# EAGLE design usbpsu2 (EAGLE 7.7.0)
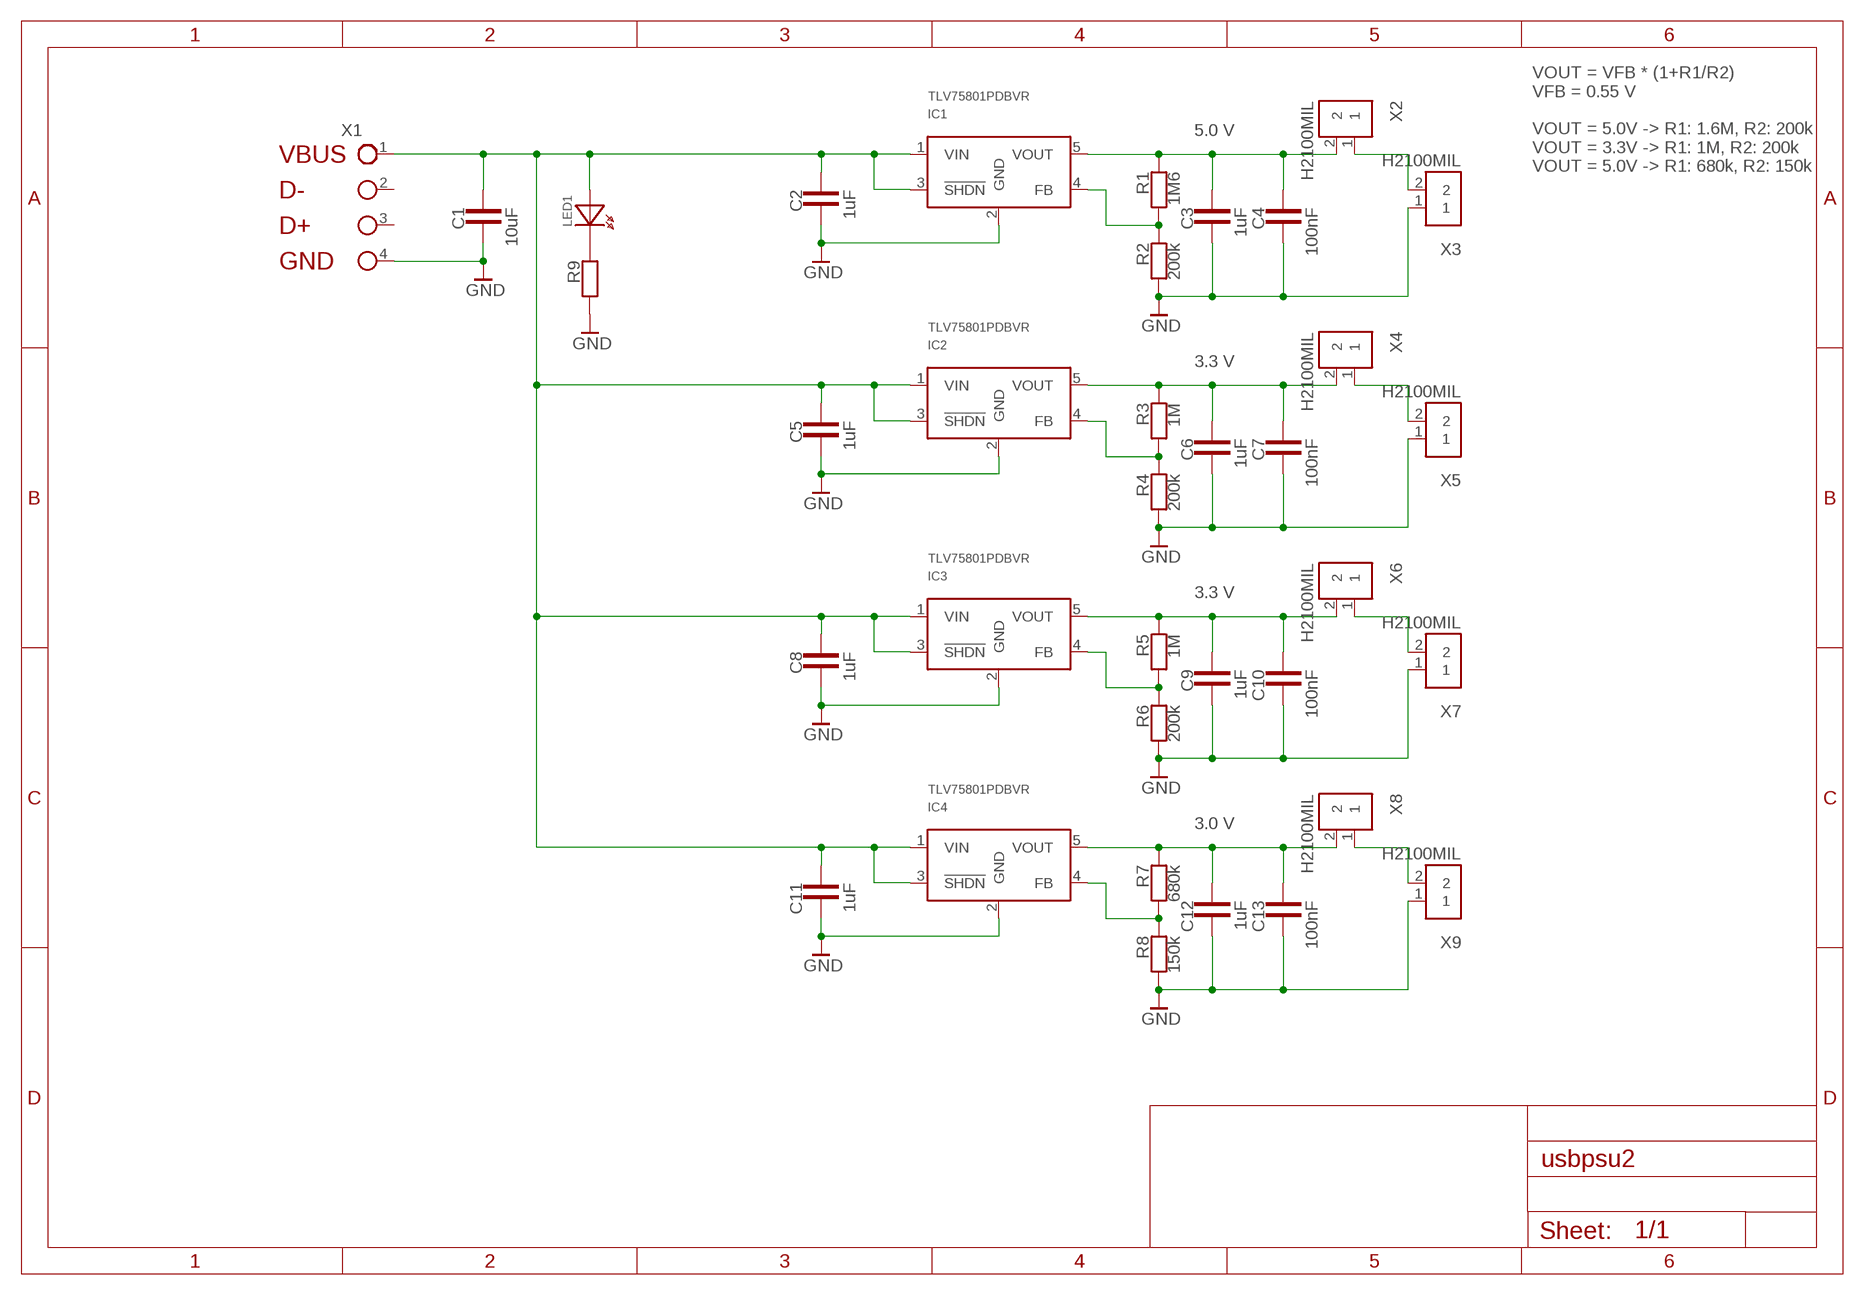
[diagram p0: schematic, sheet 1]

## Parts
C1  10uF  C0805  [0805MIL]
C2  1uF  C0805  [0805MIL]
C3  1uF  C0805  [0805MIL]
C4  100nF  C0603  [0603MIL]
C5  1uF  C0805  [0805MIL]
C6  1uF  C0805  [0805MIL]
C7  100nF  C0603  [0603MIL]
C8  1uF  C0805  [0805MIL]
C9  1uF  C0805  [0805MIL]
C10  100nF  C0603  [0603MIL]
C11  1uF  C0805  [0805MIL]
C12  1uF  C0805  [0805MIL]
C13  100nF  C0603  [0603MIL]
IC1  TLV75801PDBVR  [SOT23-5_2]
IC2  TLV75801PDBVR  [SOT23-5_2]
IC3  TLV75801PDBVR  [SOT23-5_2]
IC4  TLV75801PDBVR  [SOT23-5_2]
LED1  LED0603  [0603MIL_POL]
R1  1M6  R0603  [0603MIL]
R2  200k  R0603  [0603MIL]
R3  1M  R0603  [0603MIL]
R4  200k  R0603  [0603MIL]
R5  1M  R0603  [0603MIL]
R6  200k  R0603  [0603MIL]
R7  680k  R0603  [0603MIL]
R8  150k  R0603  [0603MIL]
R9  R0603  [0603MIL]
X1  H4USB  [HEADER4_100MIL]
X2  H2100MIL  [HEADER2_100MIL]
X3  H2100MIL  [HEADER2_100MIL]
X4  H2100MIL  [HEADER2_100MIL]
X5  H2100MIL  [HEADER2_100MIL]
X6  H2100MIL  [HEADER2_100MIL]
X7  H2100MIL  [HEADER2_100MIL]
X8  H2100MIL  [HEADER2_100MIL]
X9  H2100MIL  [HEADER2_100MIL]

## Nets
GND: C1.2 C2.2 C3.2 C4.2 C5.2 C6.2 C7.2 C8.2 C9.2 C10.2 C11.2 C12.2 C13.2 IC1.2(GND) IC2.2(GND) IC3.2(GND) IC4.2(GND) R2.2 R4.2 R6.2 R8.2 R9.2 X1.4(GND) X3.1 X5.1 X7.1 X9.1
N$1: LED1.2(K) R9.1
VBUS: C1.1 C2.1 C5.1 C8.1 C11.1 IC1.1(VIN) IC1.3(!SHDN) IC2.1(VIN) IC2.3(!SHDN) IC3.1(VIN) IC3.3(!SHDN) IC4.1(VIN) IC4.3(!SHDN) LED1.1(A) X1.1(VBUS)
VFB1: IC1.4(FB) R1.2 R2.1
VFB2: IC2.4(FB) R3.2 R4.1
VFB3: IC3.4(FB) R5.2 R6.1
VFB4: IC4.4(FB) R7.2 R8.1
VOUT1: X2.1 X3.2
VOUT1A: C3.1 C4.1 IC1.5(VOUT) R1.1 X2.2
VOUT2: X4.1 X5.2
VOUT2A: C6.1 C7.1 IC2.5(VOUT) R3.1 X4.2
VOUT3: X6.1 X7.2
VOUT3A: C9.1 C10.1 IC3.5(VOUT) R5.1 X6.2
VOUT4: X8.1 X9.2
VOUT4A: C12.1 C13.1 IC4.5(VOUT) R7.1 X8.2
Unconnected: X1.2(D-) X1.3(D+)

## Notes on the sheet
- 5.0 V
- VOUT = VFB * (1+R1/R2)
  VFB = 0.55 V
  
  VOUT = 5.0V -> R1: 1.6M, R2: 200k
  VOUT = 3.3V -> R1: 1M, R2: 200k
  VOUT = 5.0V -> R1: 680k, R2: 150k
- 3.3 V
- 3.3 V
- 3.0 V

## Library data of the parts
C1-C13 = usbpsu:C: C Kondensator im Chip-Gehäuse
IC1-IC4 = usbpsu:TLV758
LED1 = usbpsu:LED
R1-R9 = usbpsu:R: R Widerstand im Chip-Gehäuse
X1 = usbpsu:H4USB
X2-X9 = usbpsu:H2

## Board
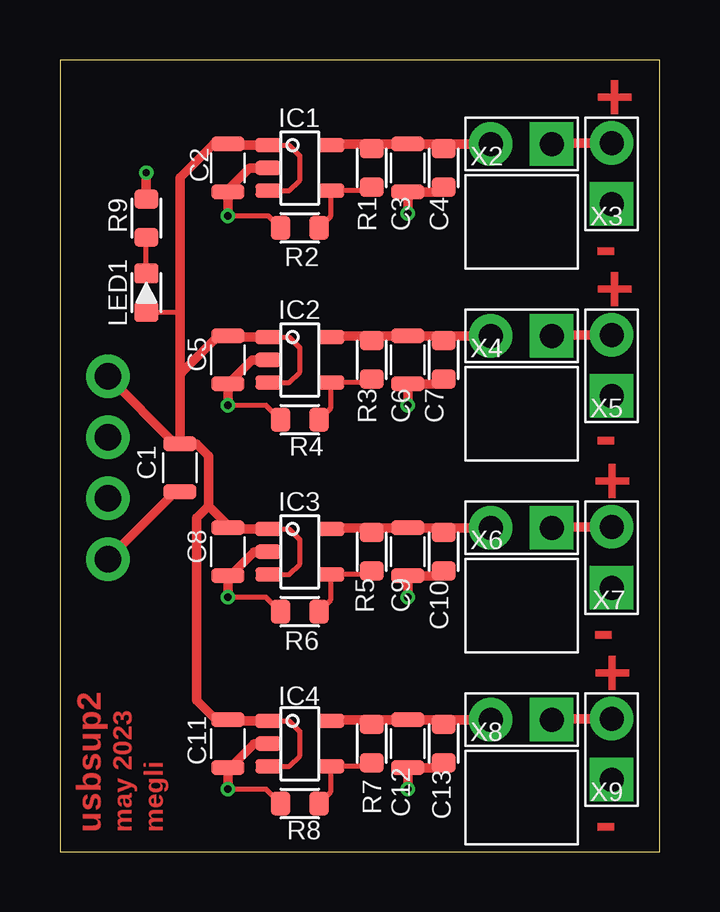
[diagram p1: board, top side]
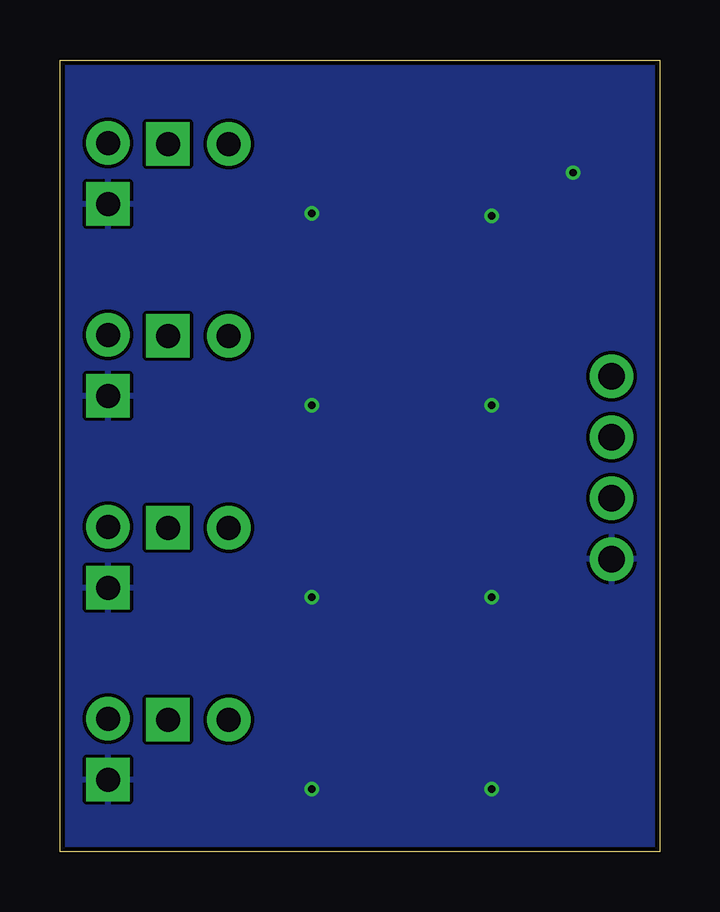
[diagram p2: board, bottom side, seen from below]

Size 25 x 33 mm. Coordinates in mm from the lower left corner, seen from the top.
Outline: 0,0 25,0 25,33 0,33 0,0
Copper layers (1*16): Top 0.035mm / dielectric 0.26mm / Bottom 0.035mm
Design rules "jlc *": minimum track width 0.15mm, minimum drill 0.2mm, track to track 0.15mm, track to pad 0.15mm, pad to pad 0.15mm, via to via 0.15mm, smd to smd 0mil, copper to edge 0.2mm, drill to drill 0.2mm, minimum pad ring 0.2mm, minimum via ring 0.15mm, stop-mask expansion 0.075mm, vias tented up to drill 0.5mm, thermal gap 0.15mm

### Footprints (pad centres in the part's own frame; a part is rotated, then mirrored left to right if it is on the bottom)
0805MIL = smd 0.6 x 1.4: 1 1,0; 2 -1,0
0603MIL = smd 0.8 x 1: 1 -0.8,0; 2 0.8,0
SOT23-5_2 = smd 1.1 x 0.6: 1 -1.3,0.95; 2 -1.3,0; 3 -1.3,-0.95; 4 1.3,-0.95; 5 1.3,0.95
0603MIL_POL = smd 0.8 x 1: 1 -0.8,0; 2 0.8,0
HEADER4_100MIL = drill 1.1 pad 1.8: 1 0,3.81; 2 0,1.27; 3 0,-1.27; 4 0,-3.81
HEADER2_100MIL = drill 1 pad 1.8 square: 1 0,0 | drill 1 pad 1.8: 2 0,-2.54

### Placement (x,y rotation side)
C1  5,16 90 top
C2  7,28.5 90 top
C3  14.5,28.5 90 top
C4  16,28.5 270 top
C5  7,20.5 90 top
C6  14.5,20.5 90 top
C7  16,20.5 270 top
C8  7,12.5 90 top
C9  14.5,12.5 90 top
C10  16,12.5 270 top
C11  7,4.5 90 top
C12  14.5,4.5 90 top
C13  16,4.5 270 top
IC1  10,28.5 0 top
IC2  10,20.5 0 top
IC3  10,12.5 0 top
IC4  10,4.5 0 top
LED1  3.6,23.3 90 top
R1  13,28.5 270 top
R2  10,26 180 top
R3  13,20.5 270 top
R4  10,18 180 top
R5  13,12.5 270 top
R6  10,10 180 top
R7  13,4.5 270 top
R8  10,2 180 top
R9  3.6,26.4 90 top
X1  2,16 0 top
X2  20.5,29.5 270 top
X3  23,27 180 top
X4  20.5,21.5 270 top
X5  23,19 180 top
X6  20.5,13.5 270 top
X7  23,11 180 top
X8  20.5,5.5 270 top
X9  23,3 180 top

### Tracks (layer width: path | path; a pad name or v marks a point on that pad's centre or on a via)
GND  (via drill 0.3)
  Top 0.2: R8.2 8.6,2.6 v7,2.6 | R6.2 8.6,10.6 v7,10.6 | R4.2 8.6,18.6 v7,18.6 | R2.2 8.7,26.5 v7,26.5
  Top 0.4: IC1.2 7.9,28.5 7,27.6 C2.2 v7,26.5 | IC3.2 8.1,12.5 7.1,11.5 C8.2 v7,10.6 | IC4.2 8.1,4.5 7.1,3.5 C11.2 v7,2.6 | IC2.2 8,20.5 C5.2 v7,18.6 | X1.4 4.81,15 C1.2 | R9.2 v3.6,28.3 | v14.5,26.6 C3.2 15.8,27.5 C4.2 | C7.2 15.8,19.5 C6.2 v14.5,18.6 | C10.2 15.8,11.5 C9.2 v14.5,10.6 | v14.5,2.6 C12.2 15.8,3.5 C13.2
  pour Bottom: 0,33 25,33 25,0 0,0
N$1
  Top 0.2: LED1.2 R9.1
VBUS
  Top 0.2: IC4.1 9.55,5.45 10,5 10,4 9.55,3.55 IC4.3 | IC1.1 9.55,29.45 10,29 10,28 9.55,27.55 IC1.3 | IC2.1 9.55,21.45 10,21 10,20 9.55,19.55 IC2.3 | IC3.1 9.55,13.45 10,13 10,12 9.55,11.55 IC3.3 | LED1.1 4.9,22.5 5,22.6
  Top 0.4: C1.1 5,20 | 5,20 5,22.6 5,28.1 6.4,29.5 C2.1 7.05,29.45 IC1.1 | 5,20 5.1,20 6.6,21.5 C5.1 7.05,21.45 IC2.1 | C1.1 5.7,17 6.2,16.5 6.2,14.4 | 6.2,14.4 7,13.6 C8.1 7.05,13.45 IC3.1 | 6.2,14.4 5.7,13.9 5.7,6.3 6.5,5.5 C11.1 7.05,5.45 IC4.1 | X1.1 4.81,17 C1.1
VFB1
  Top 0.2: R2.1 11.3,26.5 IC1.4 12.85,27.55 R1.2
VFB2
  Top 0.2: R4.1 11.3,18.5 IC2.4 12.85,19.55 R3.2
VFB3
  Top 0.2: R5.2 12.85,11.55 IC3.4 11.3,10.5 R6.1
VFB4
  Top 0.2: R8.1 11.3,2.5 IC4.4 12.85,3.55 R7.2
VOUT1
  Top 0.4: X3.2 20.54,29.54 X2.1
VOUT1A
  Top 0.4: IC1.5 11.35,29.5 13.1,29.5 | 13.1,29.5 C3.1 16,29.5 | 16,29.5 X2.2 | C4.1 16,29.5 | R1.1 13.1,29.4 13.1,29.5
VOUT2
  Top 0.4: X5.2 20.54,21.54 X4.1
VOUT2A
  Top 0.4: IC2.5 11.35,21.5 13,21.5 | 13,21.5 14.1,21.5 C6.1 16,21.5 | 16,21.5 X4.2 | C7.1 16,21.5 | R3.1 13,21.5
VOUT3
  Top 0.4: X7.2 20.54,13.54 X6.1
VOUT3A
  Top 0.4: IC3.5 11.35,13.5 13,13.5 | 13,13.5 C9.1 16,13.5 | 16,13.5 X6.2 | R5.1 13,13.5 | C10.1 16,13.5
VOUT4
  Top 0.4: X9.2 20.54,5.54 X8.1
VOUT4A
  Top 0.4: IC4.5 11.35,5.5 13,5.5 | 13,5.5 C12.1 16,5.5 | 16,5.5 X8.2 | R7.1 13,5.5 | C13.1 16,5.5

### Text on the board
Top: + | - | + | - | + | - | + | usbsup2 | may 2023 | megli | -